# Altium schematic sheet MotoDriver.SchDoc
size A4
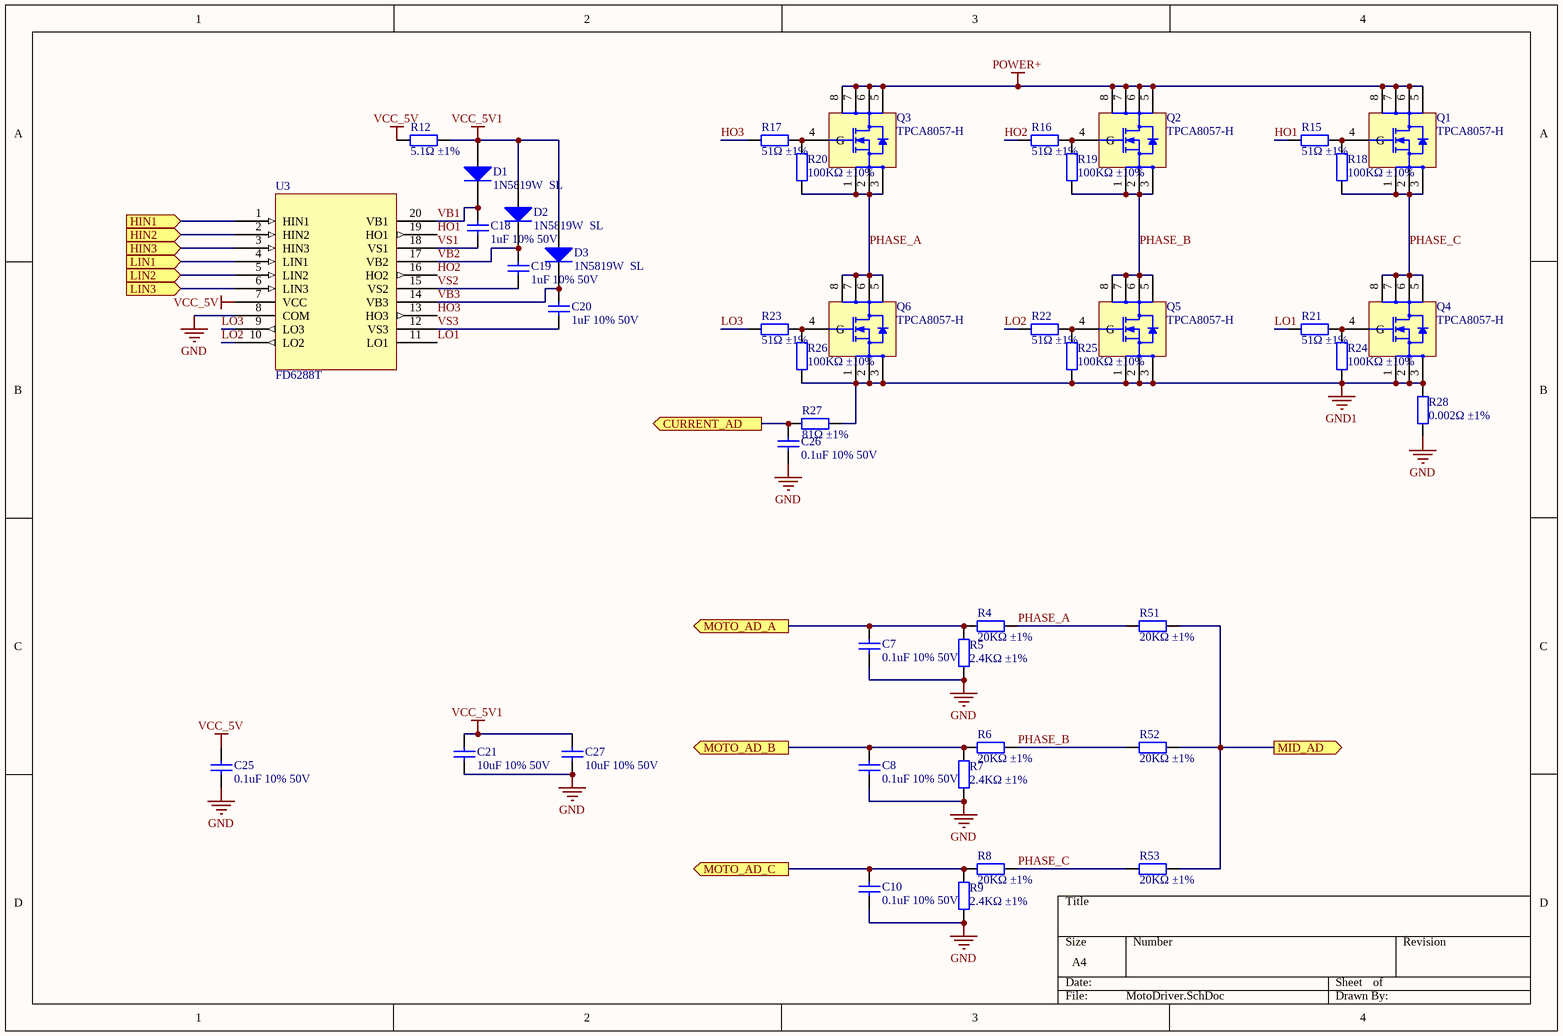
[diagram p0: MotoDriver.SchDoc]

## Parts
C7  0.1uF 10% 50V  [0603_C]
C8  0.1uF 10% 50V  [0603_C]
C10  0.1uF 10% 50V  [0603_C]
C18  1uF 10% 50V  [0805_C]
C19  1uF 10% 50V  [0805_C]
C20  1uF 10% 50V  [0805_C]
C21  10uF 10% 50V  [0805_C]
C25  0.1uF 10% 50V  [0603_C]
C26  0.1uF 10% 50V  [0603_C]
C27  10uF 10% 50V  [0805_C]
D1  1N5819W  SL  [SOD-123]
D2  1N5819W  SL  [SOD-123]
D3  1N5819W  SL  [SOD-123]
Q1  TPCA8057-H  [TPCA8057-H]
Q2  TPCA8057-H  [TPCA8057-H]
Q3  TPCA8057-H  [TPCA8057-H]
Q4  TPCA8057-H  [TPCA8057-H]
Q5  TPCA8057-H  [TPCA8057-H]
Q6  TPCA8057-H  [TPCA8057-H]
R4  20KΩ ±1%  [0603_R]
R5  2.4KΩ ±1%  [0603_R]
R6  20KΩ ±1%  [0603_R]
R7  2.4KΩ ±1%  [0603_R]
R8  20KΩ ±1%  [0603_R]
R9  2.4KΩ ±1%  [0603_R]
R12  5.1Ω ±1%  [1206_R]
R15  51Ω ±1%  [0603_R]
R16  51Ω ±1%  [0603_R]
R17  51Ω ±1%  [0603_R]
R18  100KΩ ±10%  [0603_R]
R19  100KΩ ±10%  [0603_R]
R20  100KΩ ±10%  [0603_R]
R21  51Ω ±1%  [0603_R]
R22  51Ω ±1%  [0603_R]
R23  51Ω ±1%  [0603_R]
R24  100KΩ ±10%  [0603_R]
R25  100KΩ ±10%  [0603_R]
R26  100KΩ ±10%  [0603_R]
R27  81Ω ±1%  [0603_R]
R28  0.002Ω ±1%  [RESC2512(6432)_M]
R51  20KΩ ±1%  [0603_R]
R52  20KΩ ±1%  [0603_R]
R53  20KΩ ±1%  [0603_R]
U3  FD6288T  [TSSOP20_M]

## Ports
CURRENT_AD (out), HIN1 (in), HIN2 (in), HIN3 (in), LIN1 (in), LIN2 (in), LIN3 (in), MID_AD (out), MOTO_AD_A (out), MOTO_AD_B (out), MOTO_AD_C (out)

## Nets
GND: C7.1 C8.1 C10.1 C21.1 C25.1 C26.1 C27.1 R5.1 R7.1 R9.1 R28.1 U3.8(COM)
GND1: Q4.1(S) Q4.2(S) Q4.3(S) Q5.1(S) Q5.2(S) Q5.3(S) Q6.1(S) Q6.2(S) Q6.3(S) R24.1 R25.1 R26.1 R27.2 R28.2
POWER+: Q1.5(D) Q1.6(D) Q1.7(D) Q1.8(D) Q2.5(D) Q2.6(D) Q2.7(D) Q2.8(D) Q3.5(D) Q3.6(D) Q3.7(D) Q3.8(D)
VCC_5V: C25.2 R12.1 U3.7(VCC)
VCC_5V1: C21.2 C27.2 D1.1(A) D2.1(A) D3.1(A) R12.2
CURRENT_AD: C26.2 R27.1 ; port CURRENT_AD
HIN1: U3.1(HIN1) ; port HIN1
HIN2: U3.2(HIN2) ; port HIN2
HIN3: U3.3(HIN3) ; port HIN3
HO1: R15.1 U3.19(HO1)
HO2: R16.1 U3.16(HO2)
HO3: R17.1 U3.13(HO3)
LIN1: U3.4(LIN1) ; port LIN1
LIN2: U3.5(LIN2) ; port LIN2
LIN3: U3.6(LIN3) ; port LIN3
LO1: R21.1 U3.11(LO1)
LO2: R22.1 U3.10(LO2)
LO3: R23.1 U3.9(LO3)
MID_AD: R51.2 R52.2 R53.2 ; port MID_AD
MOTO_AD_A: C7.2 R4.1 R5.2 ; port MOTO_AD_A
MOTO_AD_B: C8.2 R6.1 R7.2 ; port MOTO_AD_B
MOTO_AD_C: C10.2 R8.1 R9.2 ; port MOTO_AD_C
PHASE_A: Q3.1(S) Q3.2(S) Q3.3(S) Q6.5(D) Q6.6(D) Q6.7(D) Q6.8(D) R4.2 R20.1 R51.1
PHASE_B: Q2.1(S) Q2.2(S) Q2.3(S) Q5.5(D) Q5.6(D) Q5.7(D) Q5.8(D) R6.2 R19.1 R52.1
PHASE_C: Q1.1(S) Q1.2(S) Q1.3(S) Q4.5(D) Q4.6(D) Q4.7(D) Q4.8(D) R8.2 R18.1 R53.1
VB1: C18.2 D1.2(K) U3.20(VB1)
VB2: C19.2 D2.2(K) U3.17(VB2)
VB3: C20.2 D3.2(K) U3.14(VB3)
VS1: C18.1 U3.18(VS1)
VS2: C19.1 U3.15(VS2)
VS3: C20.1 U3.12(VS3)
NetQ1_4: Q1.4(G) R15.2 R18.2
NetQ2_4: Q2.4(G) R16.2 R19.2
NetQ3_4: Q3.4(G) R17.2 R20.2
NetQ4_4: Q4.4(G) R21.2 R24.2
NetQ5_4: Q5.4(G) R22.2 R25.2
NetQ6_4: Q6.4(G) R23.2 R26.2

## Library data of the parts
C7 C8 C10 C25-C27 = 0603 4.7uF (475) 10% 16V: 贴片电容; ComponentLink1Description: 供应商链接; ComponentLink1URL: http://www.szlcsc.com/product/details_20375.html; Package: 0603; Supplier: LC; SuppliersPartNumber: C19666
C18-C21 = 0805 1uF (105) 10% 50V: 贴片电容; ComponentLink1Description: 供应商链接; ComponentLink1URL: http://www.szlcsc.com/product/details_29074.html; Package: 0805; Supplier: LC; SuppliersPartNumber: C28323
D1-D3 = SOD-123 B5819W  SL: 肖特基二极管; ComponentLink1Description: 供应商链接; ComponentLink1URL: http://www.szlcsc.com/product/details_9093.html; Package: SOD-123; Supplier: LC; SuppliersPartNumber: C8598
Q1-Q6 = TPCA8057-H: MOSFETsSilicon N-Channel MOS (U-MOS-H)
R4-R9 R15-R28 R51-R53 = 0603 2.2Ω (2R20) 1%: 贴片电阻; ComponentLink1Description: 供应商链接; ComponentLink1URL: http://www.szlcsc.com/product/details_23666.html; Package: 0603; Supplier: LC; SuppliersPartNumber: C22939
R12 = 0402 51Ω (51R0) 1%: 贴片电阻; ComponentLink1Description: 供应商链接; ComponentLink1URL: http://www.szlcsc.com/product/details_25868.html; Package: 0402; Supplier: LC; SuppliersPartNumber: C25125
U3 = FD6288T: USB to TTL Serial / UART